# Altium schematic sheet SCH.SchDoc
size A3
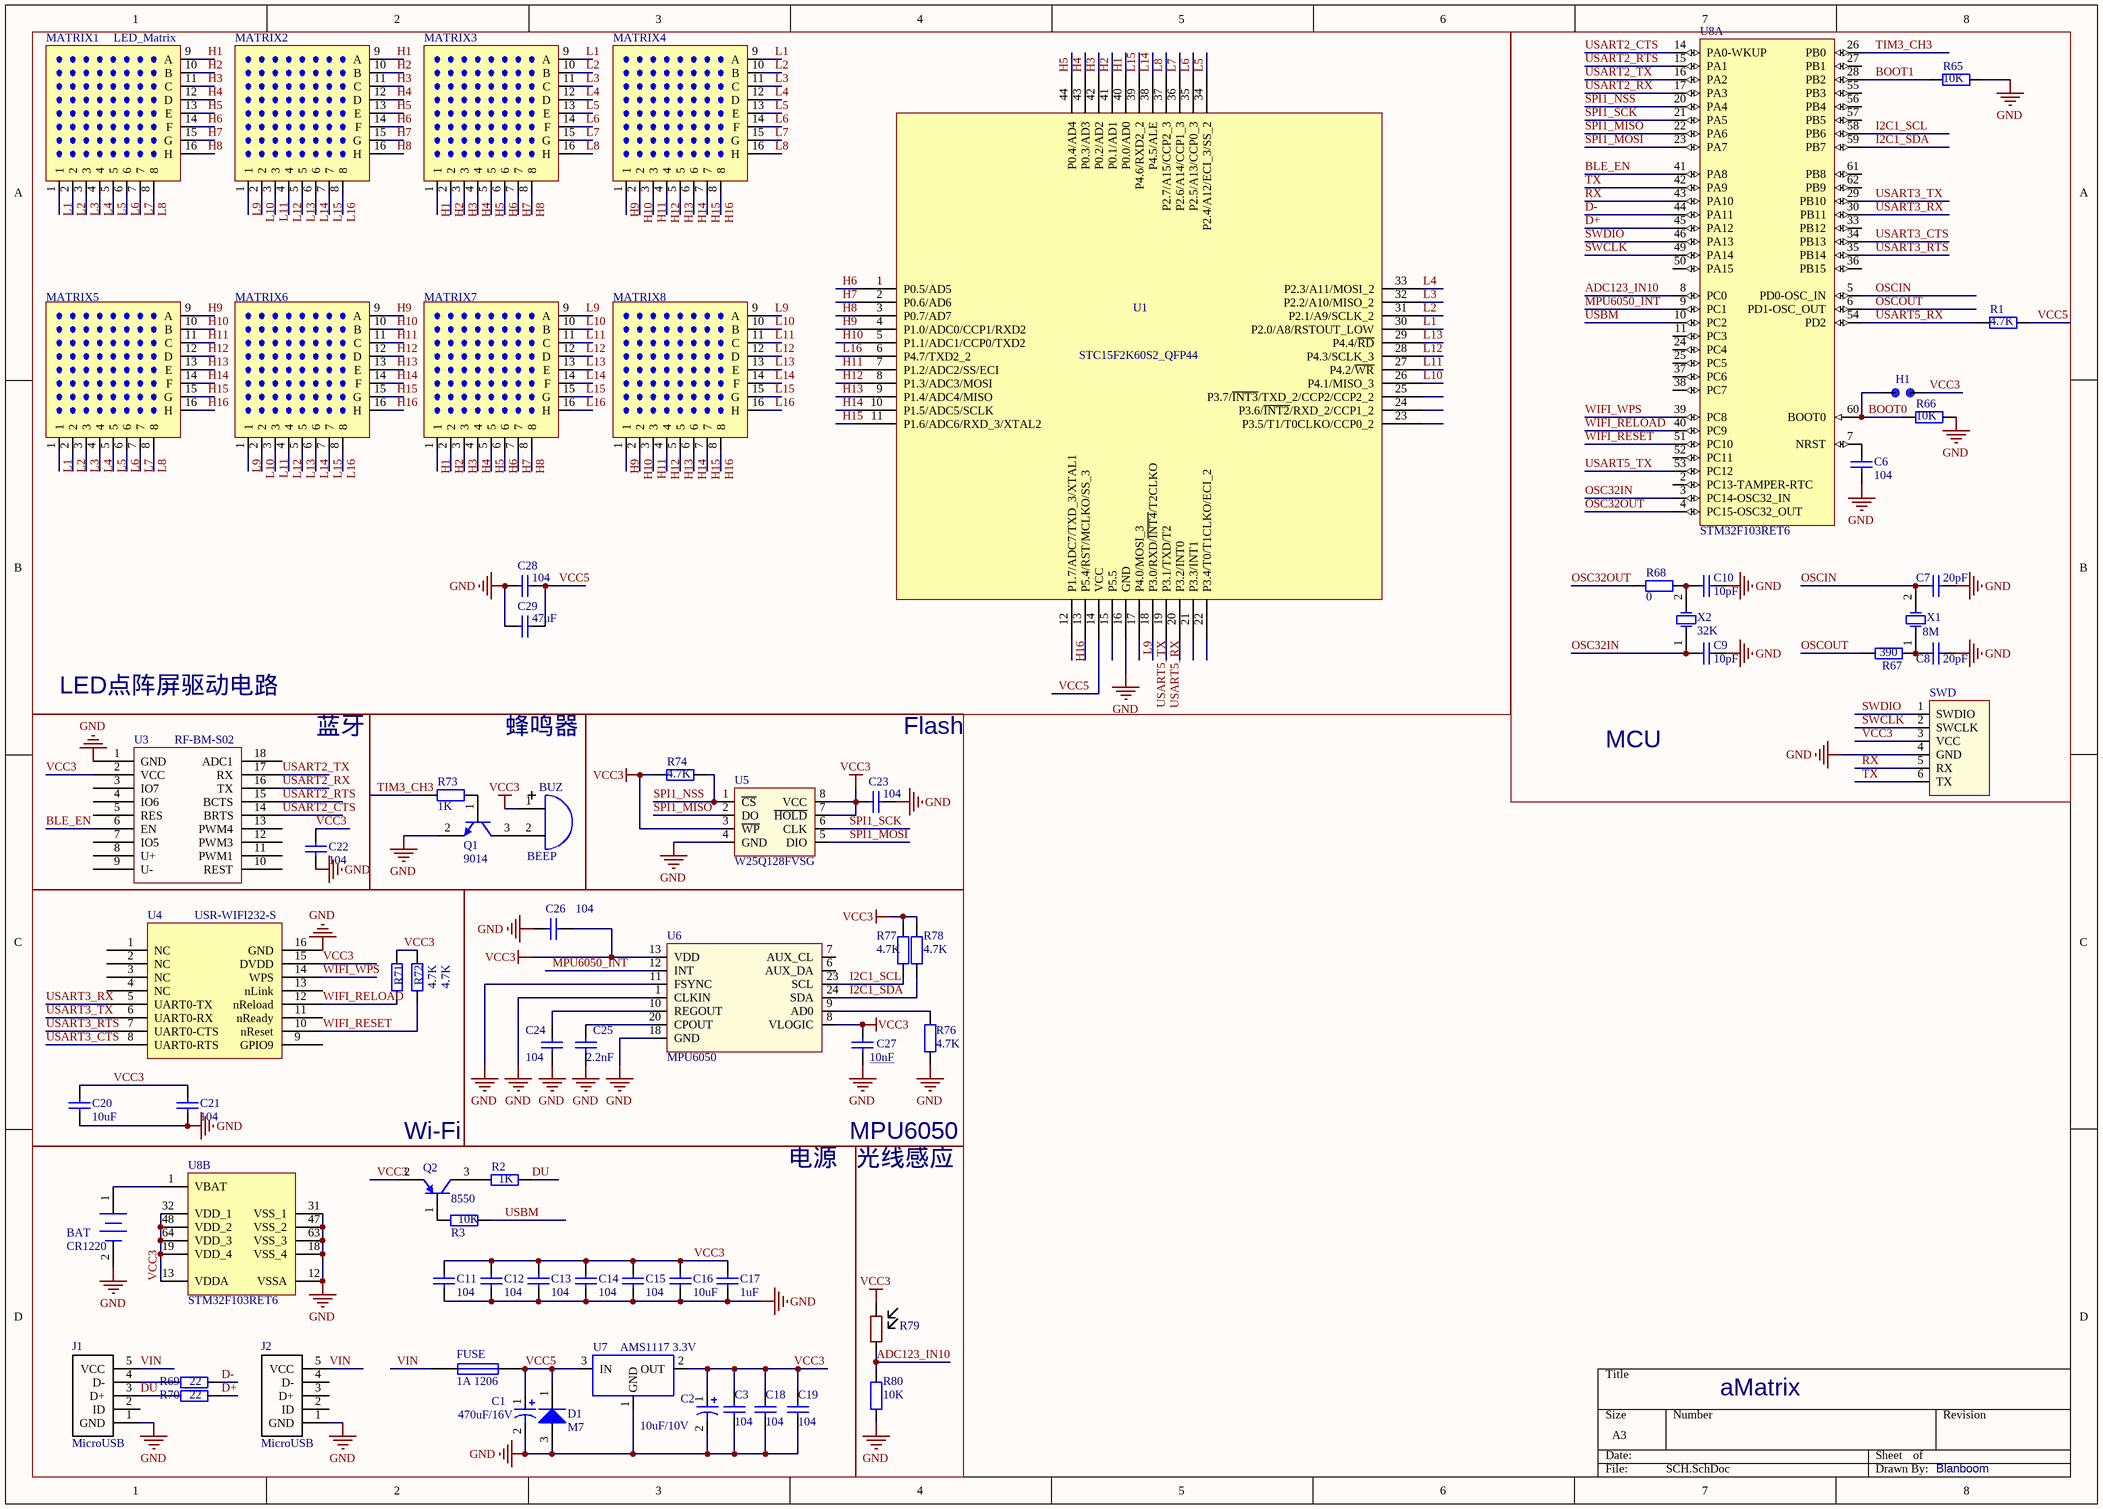
[diagram p0: SCH.SchDoc]

## Parts
BAT  CR1220  [CR1220]
BUZ  BEEP  [BEEP]
C1  value 470uF/16V  [7343]  (hidden comment: Cap Pol1)
C2  value 10uF/10V  [1206_Diode]  (hidden comment: Cap Pol1)
C3  value 104  [0805]  (hidden comment: Cap)
C6  104  [0805]
C7  value 20pF  [0805]  (hidden comment: Cap)
C8  value 20pF  [0805]  (hidden comment: Cap)
C9  value 10pF  [0805]  (hidden comment: Cap)
C10  value 10pF  [0805]  (hidden comment: Cap)
C11  value 104  [0805]  (hidden comment: Cap)
C12  value 104  [0805]  (hidden comment: Cap)
C13  value 104  [0805]  (hidden comment: Cap)
C14  value 104  [0805]  (hidden comment: Cap)
C15  value 104  [0805]  (hidden comment: Cap)
C16  value 10uF  [0805]  (hidden comment: Cap)
C17  value 1uF  [0805]  (hidden comment: Cap)
C18  value 104  [0805]  (hidden comment: Cap)
C19  value 104  [0805]  (hidden comment: Cap)
C20  value 10uF  [0805]  (hidden comment: Cap)
C21  value 104  [0805]  (hidden comment: Cap)
C22  value 104  [0805]  (hidden comment: Cap)
C23  value 104  [0805]  (hidden comment: Cap)
C24  value 104  [0805]  (hidden comment: Cap)
C25  value 2.2nF  [0805]  (hidden comment: Cap)
C26  value 104  [0805]  (hidden comment: Cap)
C27  value 10nF  [0805]  (hidden comment: Cap)
C28  value 104  [0805]  (hidden comment: Cap)
C29  value 47uF  [0805]  (hidden comment: Cap)
D1  M7  [DO-214AC]
FUSE  1A 1206  [1206]
H1  Header2  [Header2]  (value not drawn)
J1  MicroUSB  [MicroUSB]
J2  MicroUSB  [MicroUSB]
MATRIX1  LED_Matrix  [LED_Matrix]
MATRIX2  LED_Matrix  [LED_Matrix]  (value not drawn)
MATRIX3  LED_Matrix  [LED_Matrix]  (value not drawn)
MATRIX4  LED_Matrix  [LED_Matrix]  (value not drawn)
MATRIX5  LED_Matrix  [LED_Matrix]  (value not drawn)
MATRIX6  LED_Matrix  [LED_Matrix]  (value not drawn)
MATRIX7  LED_Matrix  [LED_Matrix]  (value not drawn)
MATRIX8  LED_Matrix  [LED_Matrix]  (value not drawn)
Q1  9014  [SOT-23-BJT]
Q2  8550  [SOT-23-BJT]
R1  value 4.7K  [0805]
R2  value 1K  [0805]
R3  value 10K  [0805]
R65  value 10K  [0805]  (hidden comment: Res2)
R66  value 10K  [0805]
R67  value 390  [0805]  (hidden comment: Res2)
R68  value 0  [0805]  (hidden comment: Res2)
R69  value 22  [0805]  (hidden comment: Res2)
R70  value 22  [0805]  (hidden comment: Res2)
R71  value 4.7K  [0805]  (hidden comment: Res2)
R72  value 4.7K  [0805]  (hidden comment: Res2)
R73  value 1K  [0805]  (hidden comment: Res2)
R74  value 4.7K  [0805]  (hidden comment: Res2)
R76  value 4.7K  [0805]  (hidden comment: Res2)
R77  value 4.7K  [0805]  (hidden comment: Res2)
R78  value 4.7K  [0805]  (hidden comment: Res2)
R79  Photoresistor  (value not drawn)
R80  value 10K  [0805]  (hidden comment: Res2)
SWD  SWD  [HEADER6]  (value not drawn)
U1  STC15F2K60S2_QFP44  [LQFP44]
U3  RF-BM-S02  [RF-BM-S02]
U4  USR-WIFI232-S  [USR-WIFI232-S]
U5  W25Q128FVSG  [W25_Flash]
U6  MPU6050  [MPU6050]
U7  AMS1117 3.3V  [SOT-223]
U8  STM32F103RET6  [STM-LQFP64_M]  (parts A,B of 2)
X1  8M  [XTAL_8M]
X2  32K  [XTAL_32K]

## Blocks framed on the sheet
LED点阵屏驱动电路: C28 C29 MATRIX1-MATRIX8 U1
MCU: C6-C10 H1 R1 R65-R68 SWD U8 X1 X2
蜂鸣器: BUZ Q1 R73
Flash: C23 R74 U5
Wi-Fi: C20 C21 R71 R72 U4
MPU6050: C24-C27 R76-R78 U6
电源: BAT C1-C3 C11-C19 D1 FUSE J1 J2 Q2 R2 R3 R69 R70 U7 U8
光线感应: R79 R80

## Nets
GND: BAT.2(-) C1.2 C2.2 C3.2 C6.1 C7.2 C8.2 C9.2 C10.2 C11.1 C12.1 C13.1 C14.1 C15.1 C16.1 C17.1 C18.2 C19.2 C20.1 C21.1 C22.1 C23.1 C24.2 C25.2 C26.2 C27.2 C28.2 C29.2 D1.3(A) J1.1(GND) J2.1(GND) Q1.2(E) R65.2 R66.2 R76.2 R80.2 SWD.4(GND) U1.16(GND) U3.1(GND) U4.16(GND) U5.4(GND) U6.1(CLKIN) U6.11(FSYNC) U6.18(GND) U7.1(GND) U8.12(VSSA) U8.18(VSS_4) U8.31(VSS_1) U8.47(VSS_2) U8.63(VSS_3)
VCC3: BUZ.1(A) C2.1 C3.1 C11.2 C12.2 C13.2 C14.2 C15.2 C16.2 C17.2 C18.1 C19.1 C20.2 C21.2 C22.2 C23.2 C26.1 C27.1 H1.1 Q2.2(E) R71.2 R72.2 R74.2 R77.1 R78.1 R79.1 SWD.3(VCC) U3.2(VCC) U4.15(DVDD) U5.3(~{WP}) U5.7(~{HOLD}) U5.8(VCC) U6.8(VLOGIC) U6.13(VDD) U7.2(OUT) U8.13(VDDA) U8.19(VDD_4) U8.32(VDD_1) U8.48(VDD_2) U8.64(VDD_3)
ADC123_IN10: R79.2 R80.1 U8.8(PC0)
BLE_EN: U3.6(EN) U8.41(PA8)
BOOT0: H1.2 R66.1 U8.60(BOOT0)
BOOT1: R65.1 U8.28(PB2)
D+: R70.2 U8.45(PA12)
D-: R69.2 U8.44(PA11)
DU: J1.3(D+) R2.2 R70.1
H1: MATRIX1.9(A) MATRIX2.9(A) MATRIX3.1 MATRIX7.1 U1.40(P0.0/AD0)
H2: MATRIX1.10(B) MATRIX2.10(B) MATRIX3.2 MATRIX7.2 U1.41(P0.1/AD1)
H3: MATRIX1.11(C) MATRIX2.11(C) MATRIX3.3 MATRIX7.3 U1.42(P0.2/AD2)
H4: MATRIX1.12(D) MATRIX2.12(D) MATRIX3.4 MATRIX7.4 U1.43(P0.3/AD3)
H5: MATRIX1.13(E) MATRIX2.13(E) MATRIX3.5 MATRIX7.5 U1.44(P0.4/AD4)
H6: MATRIX1.14(F) MATRIX2.14(F) MATRIX3.6 MATRIX7.6 U1.1(P0.5/AD5)
H7: MATRIX1.15(G) MATRIX2.15(G) MATRIX3.7 MATRIX7.7 U1.2(P0.6/AD6)
H8: MATRIX1.16(H) MATRIX2.16(H) MATRIX3.8 MATRIX7.8 U1.3(P0.7/AD7)
H9: MATRIX4.1 MATRIX5.9(A) MATRIX6.9(A) MATRIX8.1 U1.4(P1.0/ADC0/CCP1/RXD2)
H10: MATRIX4.2 MATRIX5.10(B) MATRIX6.10(B) MATRIX8.2 U1.5(P1.1/ADC1/CCP0/TXD2)
H11: MATRIX4.3 MATRIX5.11(C) MATRIX6.11(C) MATRIX8.3 U1.7(P1.2/ADC2/SS/ECI)
H12: MATRIX4.4 MATRIX5.12(D) MATRIX6.12(D) MATRIX8.4 U1.8(P1.3/ADC3/MOSI)
H13: MATRIX4.5 MATRIX5.13(E) MATRIX6.13(E) MATRIX8.5 U1.9(P1.4/ADC4/MISO)
H14: MATRIX4.6 MATRIX5.14(F) MATRIX6.14(F) MATRIX8.6 U1.10(P1.5/ADC5/SCLK)
H15: MATRIX4.7 MATRIX5.15(G) MATRIX6.15(G) MATRIX8.7 U1.11(P1.6/ADC6/RXD_3/XTAL2)
H16: MATRIX4.8 MATRIX5.16(H) MATRIX6.16(H) MATRIX8.8 U1.12(P1.7/ADC7/TXD_3/XTAL1)
I2C1_SCL: R77.2 U6.23(SCL) U8.58(PB6)
I2C1_SDA: R78.2 U6.24(SDA) U8.59(PB7)
L1: MATRIX1.1 MATRIX3.9(A) MATRIX4.9(A) MATRIX5.1 U1.30(P2.0/A8/RSTOUT_LOW)
L2: MATRIX1.2 MATRIX3.10(B) MATRIX4.10(B) MATRIX5.2 U1.31(P2.1/A9/SCLK_2)
L3: MATRIX1.3 MATRIX3.11(C) MATRIX4.11(C) MATRIX5.3 U1.32(P2.2/A10/MISO_2)
L4: MATRIX1.4 MATRIX3.12(D) MATRIX4.12(D) MATRIX5.4 U1.33(P2.3/A11/MOSI_2)
L5: MATRIX1.5 MATRIX3.13(E) MATRIX4.13(E) MATRIX5.5 U1.34(P2.4/A12/ECI_3/SS_2)
L6: MATRIX1.6 MATRIX3.14(F) MATRIX4.14(F) MATRIX5.6 U1.35(P2.5/A13/CCP0_3)
L7: MATRIX1.7 MATRIX3.15(G) MATRIX4.15(G) MATRIX5.7 U1.36(P2.6/A14/CCP1_3)
L8: MATRIX1.8 MATRIX3.16(H) MATRIX4.16(H) MATRIX5.8 U1.37(P2.7/A15/CCP2_3)
L9: MATRIX2.1 MATRIX6.1 MATRIX7.9(A) MATRIX8.9(A) U1.17(P4.0/MOSI_3)
L10: MATRIX2.2 MATRIX6.2 MATRIX7.10(B) MATRIX8.10(B) U1.26(P4.1/MISO_3)
L11: MATRIX2.3 MATRIX6.3 MATRIX7.11(C) MATRIX8.11(C) U1.27(P4.2/~{WR})
L12: MATRIX2.4 MATRIX6.4 MATRIX7.12(D) MATRIX8.12(D) U1.28(P4.3/SCLK_3)
L13: MATRIX2.5 MATRIX6.5 MATRIX7.13(E) MATRIX8.13(E) U1.29(P4.4/~{RD})
L14: MATRIX2.6 MATRIX6.6 MATRIX7.14(F) MATRIX8.14(F) U1.38(P4.5/ALE)
L15: MATRIX2.7 MATRIX6.7 MATRIX7.15(G) MATRIX8.15(G) U1.39(P4.6/RXD2_2)
L16: MATRIX2.8 MATRIX6.8 MATRIX7.16(H) MATRIX8.16(H) U1.6(P4.7/TXD2_2)
MPU6050_INT: U6.12(INT) U8.9(PC1)
OSC32IN: C9.1 U8.3(PC14-OSC32_IN) X2.1(OSC1)
OSC32OUT: R68.1 U8.4(PC15-OSC32_OUT)
OSCIN: C7.1 U8.5(PD0-OSC_IN) X1.2(OSC2)
OSCOUT: R67.1 U8.6(PD1-OSC_OUT)
RX: SWD.5(RX) U8.43(PA10)
SPI1_MISO: U5.2(DO) U8.22(PA6)
SPI1_MOSI: U5.5(DIO) U8.23(PA7)
SPI1_NSS: R74.1 U5.1(~{CS}) U8.20(PA4)
SPI1_SCK: U5.6(CLK) U8.21(PA5)
SWCLK: SWD.2(SWCLK) U8.49(PA14)
SWDIO: SWD.1(SWDIO) U8.46(PA13)
TIM3_CH3: R73.1 U8.26(PB0)
TX: SWD.6(TX) U8.42(PA9)
USART2_CTS: U3.14(BRTS) U8.14(PA0-WKUP)
USART2_RTS: U3.15(BCTS) U8.15(PA1)
USART2_RX: U3.16(TX) U8.17(PA3)
USART2_TX: U3.17(RX) U8.16(PA2)
USART3_CTS: U4.8(UART0-RTS) U8.34(PB13)
USART3_RTS: U4.7(UART0-CTS) U8.35(PB14)
USART3_RX: U4.5(UART0-TX) U8.30(PB11)
USART3_TX: U4.6(UART0-RX) U8.29(PB10)
USART5_RX: R1.1 U1.19(P3.1/TXD/T2) U8.54(PD2)
USART5_TX: U1.18(P3.0/RXD/~{INT4}/T2CLKO) U8.53(PC12)
USBM: R3.2 U8.10(PC2)
VCC5: C1.1 C28.1 C29.1 D1.1(K) FUSE.2 R1.2 U1.14(VCC) U7.3(IN)
VIN: FUSE.1 J1.5(VCC) J2.5(VCC)
WIFI_RELOAD: R71.1 U4.12(nReload) U8.40(PC9)
WIFI_RESET: R72.1 U4.10(nReset) U8.51(PC10)
WIFI_WPS: U4.14(WPS) U8.39(PC8)
NetBAT_1: BAT.1(+) U8.1(VBAT)
NetBUZ_2: BUZ.2(B) Q1.3(C)
NetC6_2: C6.2 U8.7(NRST)
NetC8_1: C8.1 R67.2 X1.1(OSC1)
NetC10_1: C10.1 R68.2 X2.2(OSC2)
NetC24_1: C24.1 U6.10(REGOUT)
NetC25_1: C25.1 U6.20(CPOUT)
NetJ1_4: J1.4(D-) R69.1
NetQ1_1: Q1.1(B) R73.2
NetQ2_1: Q2.1(B) R3.1
NetQ2_3: Q2.3(C) R2.1
NetR76_1: R76.1 U6.9(AD0)

Not connected (* = marked no-connect by the designer): J1 2(ID); J2 2(ID) 3(D+) 4(D-); U1 13(P5.4/RST/MCLKO/SS_3) 15(P5.5) 20(P3.2/INT0) 21(P3.3/INT1) 22(P3.4/T0/T1CLKO/ECI_2) 23(P3.5/T1/T0CLKO/CCP0_2) 24(P3.6/~{INT2}/RXD_2/CCP1_2) 25(P3.7/~{INT3}/TXD_2/CCP2/CCP2_2); U3 3(IO7) 4(IO6) 5(RES) 7(IO5) 8(U+) 9(U-) 10(REST) 11(PWM1) 12(PWM3) 13(PWM4) 18(ADC1); U4 1(NC) 2(NC) 3(NC) 4(NC) 9(GPIO9) 11(nReady) 13(nLink); U6 6(AUX_DA) 7(AUX_CL); U8 2(PC13-TAMPER-RTC) 11(PC3) 24(PC4) 25(PC5) 27(PB1) 33(PB12) 36(PB15) 37(PC6) 38(PC7) 50(PA15) 52(PC11) 55(PB3) 56(PB4) 57(PB5) 61(PB8) 62(PB9)

## Notes on the sheet
- 蓝牙
- aMatrix
- Blanboom

## Library data of the parts
BAT = Battery: Multicell Battery; Published: 24-Mar-1999; LatestRevisionDate: 17-Jul-2002; LatestRevisionNote: Re-released for DXP Platform.; PackageReference: BAT-2; Publisher: Altium Limited; PackageDescription: Battery; 2 Leads
C1 C2 = Cap Pol1: Polarized Capacitor (Radial); Published: 8-Jun-2000; LatestRevisionDate: 17-Jul-2002; LatestRevisionNote: Re-released for DXP Platform.; PackageReference: RB7.6-15; Publisher: Altium Limited; PackageDescription: Polarized Capacitor (Radial); 2 Leads
C3 C6-C29 = Cap: Capacitor; Published: 8-Jun-2000; LatestRevisionDate: 17-Jul-2002; LatestRevisionNote: Re-released for DXP Platform.; PackageReference: RAD-0.3; Publisher: Altium Limited; PackageDescription: Radial Cap, Thru-Hole; 2 Leads; 0.3 in Pin Spacing
  C6: Value: 104
D1 = Diode: Default Diode; Published: 8-Jun-2000; LatestRevisionDate: 17-Jul-2002; LatestRevisionNote: Re-released for DXP Platform.; PackageVersion: Sep-1996; PackageReference: SMC; Publisher: Altium Limited; PackageDescription: DO-214-AB/SMC; 2 C-Bend Leads; Body 7.9 x 5.9 mm, inc. leads (LxW); Code_JEDEC: DO-214-AB
FUSE = Fuse 1: Fuse; Published: 8-Jun-2000; LatestRevisionDate: 17-Jul-2002; LatestRevisionNote: Re-released for DXP Platform.; PackageReference: PIN-W2/E2.8; Publisher: Altium Limited; PackageDescription: Thru-Hole; 2 Leads
J1 J2 = MicroUSB: Imported
Q1 = 2N3904: NPN General Purpose Amplifier; Published: 8-Jun-2000; LatestRevisionDate: 15-Jan-2003; LatestRevisionNote: PCB Footprint 'BCY-W3/D4.7' replaced; DatasheetVersion: 1997; PackageVersion: Sep-1998; PackageReference: TO-92A; Publisher: Altium Limited; PackageDescription: TO, Flat Index; 3 In-Line, Axial Leads; Body Dia. 4.5mm; Leads 0.51 x 0.48 mm (max); ComponentLink1Description: Manufacturer Link; ComponentLink1URL: http://www.fairchildsemi.com/; ComponentLink2Description: Datasheet; ComponentLink2URL: http://www.fairchildsemi.com/ds/2N%2F2N3904.pdf
Q2 = 2N3906: PNP General Purpose Amplifier; Published: 8-Jun-2000; LatestRevisionDate: 15-Jan-2003; LatestRevisionNote: PCB Footprint 'BCY-W3/D4.7' replaced; DatasheetVersion: 1997; PackageVersion: Sep-1998; PackageReference: TO-92A; Publisher: Altium Limited; PackageDescription: TO, Flat Index; 3 In-Line, Axial Leads; Body Dia. 4.5mm; Leads 0.51 x 0.48 mm (max); ComponentLink1Description: Manufacturer Link; ComponentLink1URL: http://www.fairchildsemi.com/; ComponentLink2Description: Datasheet; ComponentLink2URL: http://www.fairchildsemi.com/ds/2N%2F2N3906.pdf
R1-R3 R65-R74 R76-R78 R80 = Res2: Resistor; Published: 8-Jun-2000; LatestRevisionDate: 17-Jul-2002; LatestRevisionNote: Re-released for DXP Platform.; PackageReference: AXIAL-0.4; Publisher: Altium Limited; PackageDescription: Axial Device, Thru-Hole; 2 Leads; 0.4 in Pin Spacing
U5 = W25Q128
U7 = AMS1117
U8 = STM32F103RET6: ARM Cortex-M3 32-bit MCU, 512 KB Flash, 64 KB Internal RAM, 51 I/Os, 64-pin LQFP, -40 to 85 degC, Tray; A/D Converter: 3x12-bit (16 Channel); D/A Converter: 2x12-bit (2 Channel); FLASH Size (Prog) (kB): 512; I/Os (High Current): 51; Internal RAM Size (kB): 64; Operating Frequency(F) (Processor speed) (MHz): 72; Supply Voltage(Vcc) min (V): 2; DatasheetVersion: Rev. 8; PackageVersion: Rev. 4, 06/2013; PackageReference: LQFP64; PackageDescription: 64-Pin Low Profile Quad Flat Package, 10 x 10 mm Body, 0.5 mm Pitch; Supplier 1: Digi-Key; Supplier Part Number 1: 497-6444-ND; Supplier 2: Farnell; Supplier Part Number 2: 1624138; Supplier 3: Newark; Supplier Part Number 3: 01P4101; Supplier 4: Newark; Supplier Part Number 4: 57P1231; Supplier 5: Mouser; Supplier Part Number 5: 511-STM32F103RET6; Core: ARM Cortex-M3; Packing: Tray; Mounting Technology: Surface Mount; PartNumber: STM32F103RET6; ComponentLink1Description: Manufacturer URL; ComponentLink1URL: http://www.st.com/web/en/home.html; ComponentLink2Description: Datasheet; ComponentLink2URL: http://www.st.com/st-web-ui/static/active/en/resource/technical/document/datasheet/CD00191185.pdf; ComponentLink3Description: Package Specification; ComponentLink3URL: http://www.st.com/st-web-ui/static/active/en/resource/technical/document/datasheet/DM00037051.pdf
X1 X2 = XTAL: Crystal Oscillator; Published: 8-Jun-2000; LatestRevisionDate: 17-Jul-2002; LatestRevisionNote: Re-released for DXP Platform.; PackageReference: R38; Publisher: Altium Limited; PackageDescription: Crystal, Thru-Hole; 2 Leads; Body 3.1 x 8.2 mm (Dia.xH)